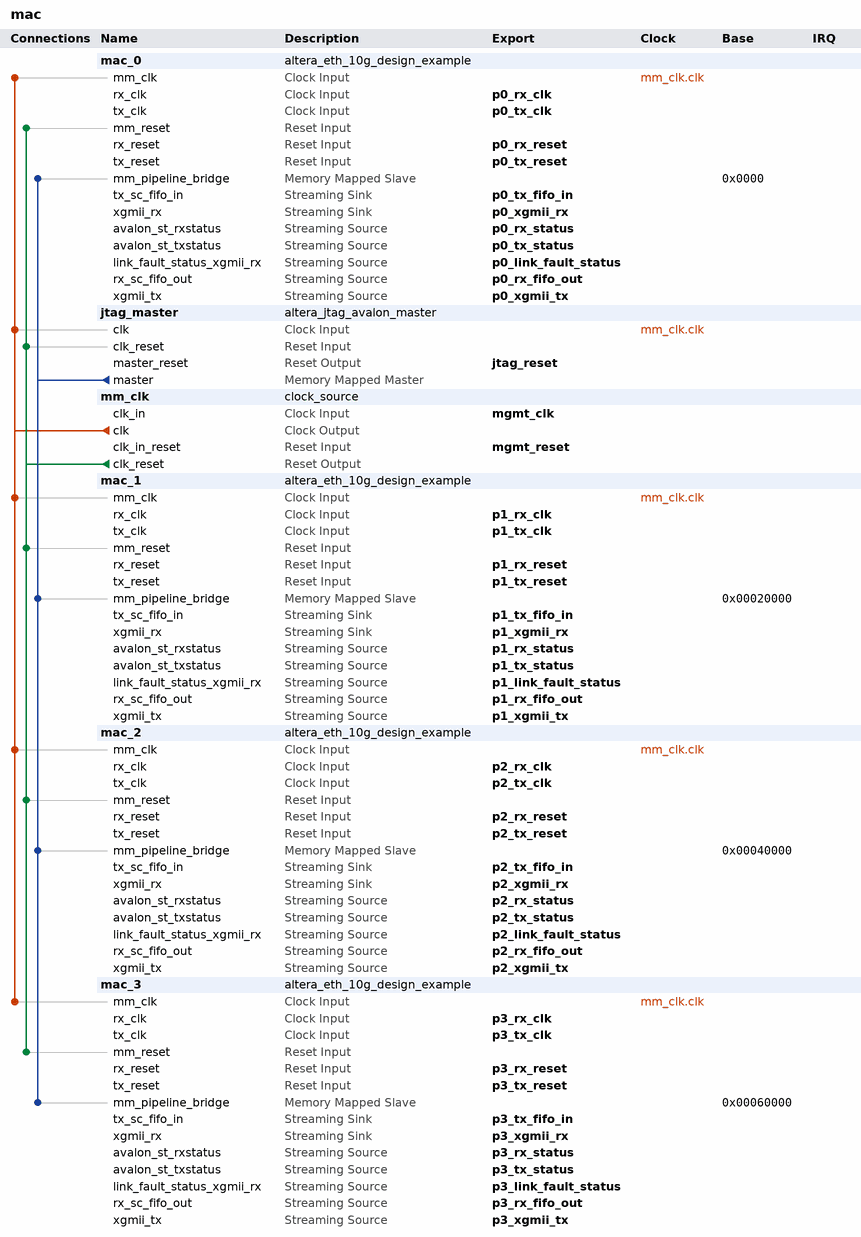
[diagram p0: system contents]
# Platform Designer (Qsys) system mac, Stratix V 5SGXEA7N2F45C2
# Parameters at their usual value, and those the tool derives, are not listed.
package require -exact qsys 14.0
create_system mac
set_project_property DEVICE_FAMILY {Stratix V}
set_project_property DEVICE 5SGXEA7N2F45C2

add_instance mac_0 altera_eth_10g_design_example 14.0
set_instance_parameter_value mac_0 DEVICE_FAMILY_TOP {Stratix V}
set_instance_parameter_value mac_0 ENABLE_MAC_LOOPBACK {10Gbps Ethernet MAC with LoopBack Enabled}
set_instance_parameter_value mac_0 CHOOSE_MDIO_2_WIRE_SERIAL_INT 1
set_instance_parameter_value mac_0 PHY_IP 2
set_instance_parameter_value mac_0 CHOOSE_FIFO 0
set_instance_parameter_value mac_0 ENABLE_TIMESTAMPING 0
set_instance_parameter_value mac_0 ENABLE_PTP_1STEP 0
set_instance_parameter_value mac_0 TSTAMP_FP_WIDTH 4
set_instance_parameter_value mac_0 PREAMBLE_PASSTHROUGH 1
set_instance_parameter_value mac_0 ENABLE_PFC 0
set_instance_parameter_value mac_0 PFC_PRIORITY_NUM 8
set_instance_parameter_value mac_0 DATAPATH_OPTION 3
set_instance_parameter_value mac_0 ENABLE_SUPP_ADDR 1
set_instance_parameter_value mac_0 INSTANTIATE_TX_CRC 1
set_instance_parameter_value mac_0 INSTANTIATE_STATISTICS 1
set_instance_parameter_value mac_0 REGISTER_BASED_STATISTICS 0
set_instance_parameter_value mac_0 ENABLE_1G10G_MAC 0
set_instance_parameter_value mac_0 ENABLE_UNIDIRECTIONAL 0
set_instance_parameter_value mac_0 MDIO_MDC_DIVISOR 32
set_instance_parameter_value mac_0 SYNC_TX_FIFO_SYMBOLS_PER_BEAT 8
set_instance_parameter_value mac_0 SYNC_TX_FIFO_BITS_PER_SYMBOL 8
set_instance_parameter_value mac_0 SYNC_TX_FIFO_DEPTH 512
set_instance_parameter_value mac_0 SYNC_TX_FIFO_ERROR_WIDTH 1
set_instance_parameter_value mac_0 SYNC_TX_USE_PACKETS 1
set_instance_parameter_value mac_0 SYNC_TX_USE_FILL 1
set_instance_parameter_value mac_0 SYNC_TX_USE_STORE_AND_FORWARD 1
set_instance_parameter_value mac_0 SYNC_TX_USE_ALMOST_FULL 0
set_instance_parameter_value mac_0 SYNC_TX_USE_ALMOST_EMPTY 0
set_instance_parameter_value mac_0 SYNC_RX_FIFO_SYMBOLS_PER_BEAT 8
set_instance_parameter_value mac_0 SYNC_RX_FIFO_BITS_PER_SYMBOL 8
set_instance_parameter_value mac_0 SYNC_RX_FIFO_DEPTH 512
set_instance_parameter_value mac_0 SYNC_RX_FIFO_ERROR_WIDTH 6
set_instance_parameter_value mac_0 SYNC_RX_USE_PACKETS 1
set_instance_parameter_value mac_0 SYNC_RX_USE_FILL 1
set_instance_parameter_value mac_0 SYNC_RX_USE_STORE_AND_FORWARD 1
set_instance_parameter_value mac_0 SYNC_RX_USE_ALMOST_FULL 1
set_instance_parameter_value mac_0 SYNC_RX_USE_ALMOST_EMPTY 1
set_instance_parameter_value mac_0 ASYNC_TX_FIFO_SYMBOLS_PER_BEAT 8
set_instance_parameter_value mac_0 ASYNC_TX_FIFO_BITS_PER_SYMBOL 8
set_instance_parameter_value mac_0 ASYNC_TX_FIFO_DEPTH 16
set_instance_parameter_value mac_0 ASYNC_TX_FIFO_ERROR_WIDTH 1
set_instance_parameter_value mac_0 ASYNC_TX_USE_PKT 1
set_instance_parameter_value mac_0 ASYNC_TX_USE_SINK_FILL 0
set_instance_parameter_value mac_0 ASYNC_TX_USE_SRC_FILL 0
set_instance_parameter_value mac_0 ASYNC_RX_FIFO_SYMBOLS_PER_BEAT 8
set_instance_parameter_value mac_0 ASYNC_RX_FIFO_BITS_PER_SYMBOL 8
set_instance_parameter_value mac_0 ASYNC_RX_FIFO_DEPTH 16
set_instance_parameter_value mac_0 ASYNC_RX_FIFO_ERROR_WIDTH 6
set_instance_parameter_value mac_0 ASYNC_RX_USE_PKT 1
set_instance_parameter_value mac_0 ASYNC_RX_USE_SINK_FILL 0
set_instance_parameter_value mac_0 ASYNC_RX_USE_SRC_FILL 0
set_instance_parameter_value mac_0 BASER_INTERFACE 0
set_instance_parameter_value mac_0 BASER_PLL_TYPE CMU
set_instance_parameter_value mac_0 BASER_STARTING_CHANNEL_NUMBER 0
set_instance_parameter_value mac_0 BASER_REF_CLK_FREQ {644.53125 MHz}
set_instance_parameter_value mac_0 BASER_TRANSMITTER_TERMINATION OCT_100_OHMS
set_instance_parameter_value mac_0 BASER_PRE_EMPHASIS_PRE_TAP 0
set_instance_parameter_value mac_0 BASER_PRE_EMPHASIS_PRE_TAP_POLARITY 0
set_instance_parameter_value mac_0 BASER_PRE_EMPHASIS_FIRST_POST_TAP 5
set_instance_parameter_value mac_0 BASER_PRE_EMPHASIS_SECOND_POST_TAP 0
set_instance_parameter_value mac_0 BASER_PRE_EMPHASIS_SECOND_POST_TAP_POLARITY 0
set_instance_parameter_value mac_0 BASER_TRANSMITTER_VOD 1
set_instance_parameter_value mac_0 BASER_RECEIVER_TERMINATION OCT_100_OHMS
set_instance_parameter_value mac_0 BASER_RECEIVER_DC_GAIN 0
set_instance_parameter_value mac_0 BASER_RECEIVER_STATIC_EQUALIZER 14
set_instance_parameter_value mac_0 BASER_EXT_PMA_CONTROL_CONF 0
set_instance_parameter_value mac_0 BASER_ENA_ADD_CONTROL_STAT 0
set_instance_parameter_value mac_0 BASER_RECOVERED_CLK_OUT 0
set_instance_parameter_value mac_0 XAUI_STARTING_CHANNEL_NUMBER 0
set_instance_parameter_value mac_0 starting_channel_number 0
set_instance_parameter_value mac_0 interface_type {Soft XAUI}
set_instance_parameter_value mac_0 soft_xaui_cfg {Only Soft XAUI is supported for this device.}
set_instance_parameter_value mac_0 hard_xaui_cfg {Only Hard XAUI is supported for this device.}
set_instance_parameter_value mac_0 gui_pll_type CMU
set_instance_parameter_value mac_0 en_synce_support 0
set_instance_parameter_value mac_0 use_control_and_status_ports 0
set_instance_parameter_value mac_0 external_pma_ctrl_reconf 0
set_instance_parameter_value mac_0 dyn_reconf 0
set_instance_parameter_value mac_0 recovered_clk_out 0
set_instance_parameter_value mac_0 number_of_interfaces 1
set_instance_parameter_value mac_0 use_rx_rate_match 0
set_instance_parameter_value mac_0 tx_termination OCT_100_OHMS
set_instance_parameter_value mac_0 tx_vod_selection 4
set_instance_parameter_value mac_0 tx_preemp_pretap 0
set_instance_parameter_value mac_0 tx_preemp_pretap_inv false
set_instance_parameter_value mac_0 tx_preemp_tap_1 0
set_instance_parameter_value mac_0 tx_preemp_tap_2 0
set_instance_parameter_value mac_0 tx_preemp_tap_2_inv false
set_instance_parameter_value mac_0 rx_common_mode 0.82v
set_instance_parameter_value mac_0 rx_termination OCT_100_OHMS
set_instance_parameter_value mac_0 rx_eq_dc_gain 0
set_instance_parameter_value mac_0 rx_eq_ctrl 0
set_instance_parameter_value mac_0 pll_external_enable 0

add_instance jtag_master altera_jtag_avalon_master 14.0

add_instance mm_clk clock_source 14.0
set_instance_parameter_value mm_clk clockFrequency 50000000

add_instance mac_1 altera_eth_10g_design_example 14.0
set_instance_parameter_value mac_1 DEVICE_FAMILY_TOP {Stratix V}
set_instance_parameter_value mac_1 ENABLE_MAC_LOOPBACK {10Gbps Ethernet MAC with LoopBack Enabled}
set_instance_parameter_value mac_1 CHOOSE_MDIO_2_WIRE_SERIAL_INT 1
set_instance_parameter_value mac_1 PHY_IP 2
set_instance_parameter_value mac_1 CHOOSE_FIFO 0
set_instance_parameter_value mac_1 ENABLE_TIMESTAMPING 0
set_instance_parameter_value mac_1 ENABLE_PTP_1STEP 0
set_instance_parameter_value mac_1 TSTAMP_FP_WIDTH 4
set_instance_parameter_value mac_1 PREAMBLE_PASSTHROUGH 1
set_instance_parameter_value mac_1 ENABLE_PFC 0
set_instance_parameter_value mac_1 PFC_PRIORITY_NUM 8
set_instance_parameter_value mac_1 DATAPATH_OPTION 3
set_instance_parameter_value mac_1 ENABLE_SUPP_ADDR 1
set_instance_parameter_value mac_1 INSTANTIATE_TX_CRC 1
set_instance_parameter_value mac_1 INSTANTIATE_STATISTICS 1
set_instance_parameter_value mac_1 REGISTER_BASED_STATISTICS 0
set_instance_parameter_value mac_1 ENABLE_1G10G_MAC 0
set_instance_parameter_value mac_1 ENABLE_UNIDIRECTIONAL 0
set_instance_parameter_value mac_1 MDIO_MDC_DIVISOR 32
set_instance_parameter_value mac_1 SYNC_TX_FIFO_SYMBOLS_PER_BEAT 8
set_instance_parameter_value mac_1 SYNC_TX_FIFO_BITS_PER_SYMBOL 8
set_instance_parameter_value mac_1 SYNC_TX_FIFO_DEPTH 512
set_instance_parameter_value mac_1 SYNC_TX_FIFO_ERROR_WIDTH 1
set_instance_parameter_value mac_1 SYNC_TX_USE_PACKETS 1
set_instance_parameter_value mac_1 SYNC_TX_USE_FILL 1
set_instance_parameter_value mac_1 SYNC_TX_USE_STORE_AND_FORWARD 1
set_instance_parameter_value mac_1 SYNC_TX_USE_ALMOST_FULL 0
set_instance_parameter_value mac_1 SYNC_TX_USE_ALMOST_EMPTY 0
set_instance_parameter_value mac_1 SYNC_RX_FIFO_SYMBOLS_PER_BEAT 8
set_instance_parameter_value mac_1 SYNC_RX_FIFO_BITS_PER_SYMBOL 8
set_instance_parameter_value mac_1 SYNC_RX_FIFO_DEPTH 512
set_instance_parameter_value mac_1 SYNC_RX_FIFO_ERROR_WIDTH 6
set_instance_parameter_value mac_1 SYNC_RX_USE_PACKETS 1
set_instance_parameter_value mac_1 SYNC_RX_USE_FILL 1
set_instance_parameter_value mac_1 SYNC_RX_USE_STORE_AND_FORWARD 1
set_instance_parameter_value mac_1 SYNC_RX_USE_ALMOST_FULL 1
set_instance_parameter_value mac_1 SYNC_RX_USE_ALMOST_EMPTY 1
set_instance_parameter_value mac_1 ASYNC_TX_FIFO_SYMBOLS_PER_BEAT 8
set_instance_parameter_value mac_1 ASYNC_TX_FIFO_BITS_PER_SYMBOL 8
set_instance_parameter_value mac_1 ASYNC_TX_FIFO_DEPTH 16
set_instance_parameter_value mac_1 ASYNC_TX_FIFO_ERROR_WIDTH 1
set_instance_parameter_value mac_1 ASYNC_TX_USE_PKT 1
set_instance_parameter_value mac_1 ASYNC_TX_USE_SINK_FILL 0
set_instance_parameter_value mac_1 ASYNC_TX_USE_SRC_FILL 0
set_instance_parameter_value mac_1 ASYNC_RX_FIFO_SYMBOLS_PER_BEAT 8
set_instance_parameter_value mac_1 ASYNC_RX_FIFO_BITS_PER_SYMBOL 8
set_instance_parameter_value mac_1 ASYNC_RX_FIFO_DEPTH 16
set_instance_parameter_value mac_1 ASYNC_RX_FIFO_ERROR_WIDTH 6
set_instance_parameter_value mac_1 ASYNC_RX_USE_PKT 1
set_instance_parameter_value mac_1 ASYNC_RX_USE_SINK_FILL 0
set_instance_parameter_value mac_1 ASYNC_RX_USE_SRC_FILL 0
set_instance_parameter_value mac_1 BASER_INTERFACE 0
set_instance_parameter_value mac_1 BASER_PLL_TYPE CMU
set_instance_parameter_value mac_1 BASER_STARTING_CHANNEL_NUMBER 0
set_instance_parameter_value mac_1 BASER_REF_CLK_FREQ {644.53125 MHz}
set_instance_parameter_value mac_1 BASER_TRANSMITTER_TERMINATION OCT_100_OHMS
set_instance_parameter_value mac_1 BASER_PRE_EMPHASIS_PRE_TAP 0
set_instance_parameter_value mac_1 BASER_PRE_EMPHASIS_PRE_TAP_POLARITY 0
set_instance_parameter_value mac_1 BASER_PRE_EMPHASIS_FIRST_POST_TAP 5
set_instance_parameter_value mac_1 BASER_PRE_EMPHASIS_SECOND_POST_TAP 0
set_instance_parameter_value mac_1 BASER_PRE_EMPHASIS_SECOND_POST_TAP_POLARITY 0
set_instance_parameter_value mac_1 BASER_TRANSMITTER_VOD 1
set_instance_parameter_value mac_1 BASER_RECEIVER_TERMINATION OCT_100_OHMS
set_instance_parameter_value mac_1 BASER_RECEIVER_DC_GAIN 0
set_instance_parameter_value mac_1 BASER_RECEIVER_STATIC_EQUALIZER 14
set_instance_parameter_value mac_1 BASER_EXT_PMA_CONTROL_CONF 0
set_instance_parameter_value mac_1 BASER_ENA_ADD_CONTROL_STAT 0
set_instance_parameter_value mac_1 BASER_RECOVERED_CLK_OUT 0
set_instance_parameter_value mac_1 XAUI_STARTING_CHANNEL_NUMBER 0
set_instance_parameter_value mac_1 starting_channel_number 0
set_instance_parameter_value mac_1 interface_type {Soft XAUI}
set_instance_parameter_value mac_1 soft_xaui_cfg {Only Soft XAUI is supported for this device.}
set_instance_parameter_value mac_1 hard_xaui_cfg {Only Hard XAUI is supported for this device.}
set_instance_parameter_value mac_1 gui_pll_type CMU
set_instance_parameter_value mac_1 en_synce_support 0
set_instance_parameter_value mac_1 use_control_and_status_ports 0
set_instance_parameter_value mac_1 external_pma_ctrl_reconf 0
set_instance_parameter_value mac_1 dyn_reconf 0
set_instance_parameter_value mac_1 recovered_clk_out 0
set_instance_parameter_value mac_1 number_of_interfaces 1
set_instance_parameter_value mac_1 use_rx_rate_match 0
set_instance_parameter_value mac_1 tx_termination OCT_100_OHMS
set_instance_parameter_value mac_1 tx_vod_selection 4
set_instance_parameter_value mac_1 tx_preemp_pretap 0
set_instance_parameter_value mac_1 tx_preemp_pretap_inv false
set_instance_parameter_value mac_1 tx_preemp_tap_1 0
set_instance_parameter_value mac_1 tx_preemp_tap_2 0
set_instance_parameter_value mac_1 tx_preemp_tap_2_inv false
set_instance_parameter_value mac_1 rx_common_mode 0.82v
set_instance_parameter_value mac_1 rx_termination OCT_100_OHMS
set_instance_parameter_value mac_1 rx_eq_dc_gain 0
set_instance_parameter_value mac_1 rx_eq_ctrl 0
set_instance_parameter_value mac_1 pll_external_enable 0

add_instance mac_2 altera_eth_10g_design_example 14.0
set_instance_parameter_value mac_2 DEVICE_FAMILY_TOP {Stratix V}
set_instance_parameter_value mac_2 ENABLE_MAC_LOOPBACK {10Gbps Ethernet MAC with LoopBack Enabled}
set_instance_parameter_value mac_2 CHOOSE_MDIO_2_WIRE_SERIAL_INT 1
set_instance_parameter_value mac_2 PHY_IP 2
set_instance_parameter_value mac_2 CHOOSE_FIFO 0
set_instance_parameter_value mac_2 ENABLE_TIMESTAMPING 0
set_instance_parameter_value mac_2 ENABLE_PTP_1STEP 0
set_instance_parameter_value mac_2 TSTAMP_FP_WIDTH 4
set_instance_parameter_value mac_2 PREAMBLE_PASSTHROUGH 1
set_instance_parameter_value mac_2 ENABLE_PFC 0
set_instance_parameter_value mac_2 PFC_PRIORITY_NUM 8
set_instance_parameter_value mac_2 DATAPATH_OPTION 3
set_instance_parameter_value mac_2 ENABLE_SUPP_ADDR 1
set_instance_parameter_value mac_2 INSTANTIATE_TX_CRC 1
set_instance_parameter_value mac_2 INSTANTIATE_STATISTICS 1
set_instance_parameter_value mac_2 REGISTER_BASED_STATISTICS 0
set_instance_parameter_value mac_2 ENABLE_1G10G_MAC 0
set_instance_parameter_value mac_2 ENABLE_UNIDIRECTIONAL 0
set_instance_parameter_value mac_2 MDIO_MDC_DIVISOR 32
set_instance_parameter_value mac_2 SYNC_TX_FIFO_SYMBOLS_PER_BEAT 8
set_instance_parameter_value mac_2 SYNC_TX_FIFO_BITS_PER_SYMBOL 8
set_instance_parameter_value mac_2 SYNC_TX_FIFO_DEPTH 512
set_instance_parameter_value mac_2 SYNC_TX_FIFO_ERROR_WIDTH 1
set_instance_parameter_value mac_2 SYNC_TX_USE_PACKETS 1
set_instance_parameter_value mac_2 SYNC_TX_USE_FILL 1
set_instance_parameter_value mac_2 SYNC_TX_USE_STORE_AND_FORWARD 1
set_instance_parameter_value mac_2 SYNC_TX_USE_ALMOST_FULL 0
set_instance_parameter_value mac_2 SYNC_TX_USE_ALMOST_EMPTY 0
set_instance_parameter_value mac_2 SYNC_RX_FIFO_SYMBOLS_PER_BEAT 8
set_instance_parameter_value mac_2 SYNC_RX_FIFO_BITS_PER_SYMBOL 8
set_instance_parameter_value mac_2 SYNC_RX_FIFO_DEPTH 512
set_instance_parameter_value mac_2 SYNC_RX_FIFO_ERROR_WIDTH 6
set_instance_parameter_value mac_2 SYNC_RX_USE_PACKETS 1
set_instance_parameter_value mac_2 SYNC_RX_USE_FILL 1
set_instance_parameter_value mac_2 SYNC_RX_USE_STORE_AND_FORWARD 1
set_instance_parameter_value mac_2 SYNC_RX_USE_ALMOST_FULL 1
set_instance_parameter_value mac_2 SYNC_RX_USE_ALMOST_EMPTY 1
set_instance_parameter_value mac_2 ASYNC_TX_FIFO_SYMBOLS_PER_BEAT 8
set_instance_parameter_value mac_2 ASYNC_TX_FIFO_BITS_PER_SYMBOL 8
set_instance_parameter_value mac_2 ASYNC_TX_FIFO_DEPTH 16
set_instance_parameter_value mac_2 ASYNC_TX_FIFO_ERROR_WIDTH 1
set_instance_parameter_value mac_2 ASYNC_TX_USE_PKT 1
set_instance_parameter_value mac_2 ASYNC_TX_USE_SINK_FILL 0
set_instance_parameter_value mac_2 ASYNC_TX_USE_SRC_FILL 0
set_instance_parameter_value mac_2 ASYNC_RX_FIFO_SYMBOLS_PER_BEAT 8
set_instance_parameter_value mac_2 ASYNC_RX_FIFO_BITS_PER_SYMBOL 8
set_instance_parameter_value mac_2 ASYNC_RX_FIFO_DEPTH 16
set_instance_parameter_value mac_2 ASYNC_RX_FIFO_ERROR_WIDTH 6
set_instance_parameter_value mac_2 ASYNC_RX_USE_PKT 1
set_instance_parameter_value mac_2 ASYNC_RX_USE_SINK_FILL 0
set_instance_parameter_value mac_2 ASYNC_RX_USE_SRC_FILL 0
set_instance_parameter_value mac_2 BASER_INTERFACE 0
set_instance_parameter_value mac_2 BASER_PLL_TYPE CMU
set_instance_parameter_value mac_2 BASER_STARTING_CHANNEL_NUMBER 0
set_instance_parameter_value mac_2 BASER_REF_CLK_FREQ {644.53125 MHz}
set_instance_parameter_value mac_2 BASER_TRANSMITTER_TERMINATION OCT_100_OHMS
set_instance_parameter_value mac_2 BASER_PRE_EMPHASIS_PRE_TAP 0
set_instance_parameter_value mac_2 BASER_PRE_EMPHASIS_PRE_TAP_POLARITY 0
set_instance_parameter_value mac_2 BASER_PRE_EMPHASIS_FIRST_POST_TAP 5
set_instance_parameter_value mac_2 BASER_PRE_EMPHASIS_SECOND_POST_TAP 0
set_instance_parameter_value mac_2 BASER_PRE_EMPHASIS_SECOND_POST_TAP_POLARITY 0
set_instance_parameter_value mac_2 BASER_TRANSMITTER_VOD 1
set_instance_parameter_value mac_2 BASER_RECEIVER_TERMINATION OCT_100_OHMS
set_instance_parameter_value mac_2 BASER_RECEIVER_DC_GAIN 0
set_instance_parameter_value mac_2 BASER_RECEIVER_STATIC_EQUALIZER 14
set_instance_parameter_value mac_2 BASER_EXT_PMA_CONTROL_CONF 0
set_instance_parameter_value mac_2 BASER_ENA_ADD_CONTROL_STAT 0
set_instance_parameter_value mac_2 BASER_RECOVERED_CLK_OUT 0
set_instance_parameter_value mac_2 XAUI_STARTING_CHANNEL_NUMBER 0
set_instance_parameter_value mac_2 starting_channel_number 0
set_instance_parameter_value mac_2 interface_type {Soft XAUI}
set_instance_parameter_value mac_2 soft_xaui_cfg {Only Soft XAUI is supported for this device.}
set_instance_parameter_value mac_2 hard_xaui_cfg {Only Hard XAUI is supported for this device.}
set_instance_parameter_value mac_2 gui_pll_type CMU
set_instance_parameter_value mac_2 en_synce_support 0
set_instance_parameter_value mac_2 use_control_and_status_ports 0
set_instance_parameter_value mac_2 external_pma_ctrl_reconf 0
set_instance_parameter_value mac_2 dyn_reconf 0
set_instance_parameter_value mac_2 recovered_clk_out 0
set_instance_parameter_value mac_2 number_of_interfaces 1
set_instance_parameter_value mac_2 use_rx_rate_match 0
set_instance_parameter_value mac_2 tx_termination OCT_100_OHMS
set_instance_parameter_value mac_2 tx_vod_selection 4
set_instance_parameter_value mac_2 tx_preemp_pretap 0
set_instance_parameter_value mac_2 tx_preemp_pretap_inv false
set_instance_parameter_value mac_2 tx_preemp_tap_1 0
set_instance_parameter_value mac_2 tx_preemp_tap_2 0
set_instance_parameter_value mac_2 tx_preemp_tap_2_inv false
set_instance_parameter_value mac_2 rx_common_mode 0.82v
set_instance_parameter_value mac_2 rx_termination OCT_100_OHMS
set_instance_parameter_value mac_2 rx_eq_dc_gain 0
set_instance_parameter_value mac_2 rx_eq_ctrl 0
set_instance_parameter_value mac_2 pll_external_enable 0

add_instance mac_3 altera_eth_10g_design_example 14.0
set_instance_parameter_value mac_3 DEVICE_FAMILY_TOP {Stratix V}
set_instance_parameter_value mac_3 ENABLE_MAC_LOOPBACK {10Gbps Ethernet MAC with LoopBack Enabled}
set_instance_parameter_value mac_3 CHOOSE_MDIO_2_WIRE_SERIAL_INT 1
set_instance_parameter_value mac_3 PHY_IP 2
set_instance_parameter_value mac_3 CHOOSE_FIFO 0
set_instance_parameter_value mac_3 ENABLE_TIMESTAMPING 0
set_instance_parameter_value mac_3 ENABLE_PTP_1STEP 0
set_instance_parameter_value mac_3 TSTAMP_FP_WIDTH 4
set_instance_parameter_value mac_3 PREAMBLE_PASSTHROUGH 1
set_instance_parameter_value mac_3 ENABLE_PFC 0
set_instance_parameter_value mac_3 PFC_PRIORITY_NUM 8
set_instance_parameter_value mac_3 DATAPATH_OPTION 3
set_instance_parameter_value mac_3 ENABLE_SUPP_ADDR 1
set_instance_parameter_value mac_3 INSTANTIATE_TX_CRC 1
set_instance_parameter_value mac_3 INSTANTIATE_STATISTICS 1
set_instance_parameter_value mac_3 REGISTER_BASED_STATISTICS 0
set_instance_parameter_value mac_3 ENABLE_1G10G_MAC 0
set_instance_parameter_value mac_3 ENABLE_UNIDIRECTIONAL 0
set_instance_parameter_value mac_3 MDIO_MDC_DIVISOR 32
set_instance_parameter_value mac_3 SYNC_TX_FIFO_SYMBOLS_PER_BEAT 8
set_instance_parameter_value mac_3 SYNC_TX_FIFO_BITS_PER_SYMBOL 8
set_instance_parameter_value mac_3 SYNC_TX_FIFO_DEPTH 512
set_instance_parameter_value mac_3 SYNC_TX_FIFO_ERROR_WIDTH 1
set_instance_parameter_value mac_3 SYNC_TX_USE_PACKETS 1
set_instance_parameter_value mac_3 SYNC_TX_USE_FILL 1
set_instance_parameter_value mac_3 SYNC_TX_USE_STORE_AND_FORWARD 1
set_instance_parameter_value mac_3 SYNC_TX_USE_ALMOST_FULL 0
set_instance_parameter_value mac_3 SYNC_TX_USE_ALMOST_EMPTY 0
set_instance_parameter_value mac_3 SYNC_RX_FIFO_SYMBOLS_PER_BEAT 8
set_instance_parameter_value mac_3 SYNC_RX_FIFO_BITS_PER_SYMBOL 8
set_instance_parameter_value mac_3 SYNC_RX_FIFO_DEPTH 512
set_instance_parameter_value mac_3 SYNC_RX_FIFO_ERROR_WIDTH 6
set_instance_parameter_value mac_3 SYNC_RX_USE_PACKETS 1
set_instance_parameter_value mac_3 SYNC_RX_USE_FILL 1
set_instance_parameter_value mac_3 SYNC_RX_USE_STORE_AND_FORWARD 1
set_instance_parameter_value mac_3 SYNC_RX_USE_ALMOST_FULL 1
set_instance_parameter_value mac_3 SYNC_RX_USE_ALMOST_EMPTY 1
set_instance_parameter_value mac_3 ASYNC_TX_FIFO_SYMBOLS_PER_BEAT 8
set_instance_parameter_value mac_3 ASYNC_TX_FIFO_BITS_PER_SYMBOL 8
set_instance_parameter_value mac_3 ASYNC_TX_FIFO_DEPTH 16
set_instance_parameter_value mac_3 ASYNC_TX_FIFO_ERROR_WIDTH 1
set_instance_parameter_value mac_3 ASYNC_TX_USE_PKT 1
set_instance_parameter_value mac_3 ASYNC_TX_USE_SINK_FILL 0
set_instance_parameter_value mac_3 ASYNC_TX_USE_SRC_FILL 0
set_instance_parameter_value mac_3 ASYNC_RX_FIFO_SYMBOLS_PER_BEAT 8
set_instance_parameter_value mac_3 ASYNC_RX_FIFO_BITS_PER_SYMBOL 8
set_instance_parameter_value mac_3 ASYNC_RX_FIFO_DEPTH 16
set_instance_parameter_value mac_3 ASYNC_RX_FIFO_ERROR_WIDTH 6
set_instance_parameter_value mac_3 ASYNC_RX_USE_PKT 1
set_instance_parameter_value mac_3 ASYNC_RX_USE_SINK_FILL 0
set_instance_parameter_value mac_3 ASYNC_RX_USE_SRC_FILL 0
set_instance_parameter_value mac_3 BASER_INTERFACE 0
set_instance_parameter_value mac_3 BASER_PLL_TYPE CMU
set_instance_parameter_value mac_3 BASER_STARTING_CHANNEL_NUMBER 0
set_instance_parameter_value mac_3 BASER_REF_CLK_FREQ {644.53125 MHz}
set_instance_parameter_value mac_3 BASER_TRANSMITTER_TERMINATION OCT_100_OHMS
set_instance_parameter_value mac_3 BASER_PRE_EMPHASIS_PRE_TAP 0
set_instance_parameter_value mac_3 BASER_PRE_EMPHASIS_PRE_TAP_POLARITY 0
set_instance_parameter_value mac_3 BASER_PRE_EMPHASIS_FIRST_POST_TAP 5
set_instance_parameter_value mac_3 BASER_PRE_EMPHASIS_SECOND_POST_TAP 0
set_instance_parameter_value mac_3 BASER_PRE_EMPHASIS_SECOND_POST_TAP_POLARITY 0
set_instance_parameter_value mac_3 BASER_TRANSMITTER_VOD 1
set_instance_parameter_value mac_3 BASER_RECEIVER_TERMINATION OCT_100_OHMS
set_instance_parameter_value mac_3 BASER_RECEIVER_DC_GAIN 0
set_instance_parameter_value mac_3 BASER_RECEIVER_STATIC_EQUALIZER 14
set_instance_parameter_value mac_3 BASER_EXT_PMA_CONTROL_CONF 0
set_instance_parameter_value mac_3 BASER_ENA_ADD_CONTROL_STAT 0
set_instance_parameter_value mac_3 BASER_RECOVERED_CLK_OUT 0
set_instance_parameter_value mac_3 XAUI_STARTING_CHANNEL_NUMBER 0
set_instance_parameter_value mac_3 starting_channel_number 0
set_instance_parameter_value mac_3 interface_type {Soft XAUI}
set_instance_parameter_value mac_3 soft_xaui_cfg {Only Soft XAUI is supported for this device.}
set_instance_parameter_value mac_3 hard_xaui_cfg {Only Hard XAUI is supported for this device.}
set_instance_parameter_value mac_3 gui_pll_type CMU
set_instance_parameter_value mac_3 en_synce_support 0
set_instance_parameter_value mac_3 use_control_and_status_ports 0
set_instance_parameter_value mac_3 external_pma_ctrl_reconf 0
set_instance_parameter_value mac_3 dyn_reconf 0
set_instance_parameter_value mac_3 recovered_clk_out 0
set_instance_parameter_value mac_3 number_of_interfaces 1
set_instance_parameter_value mac_3 use_rx_rate_match 0
set_instance_parameter_value mac_3 tx_termination OCT_100_OHMS
set_instance_parameter_value mac_3 tx_vod_selection 4
set_instance_parameter_value mac_3 tx_preemp_pretap 0
set_instance_parameter_value mac_3 tx_preemp_pretap_inv false
set_instance_parameter_value mac_3 tx_preemp_tap_1 0
set_instance_parameter_value mac_3 tx_preemp_tap_2 0
set_instance_parameter_value mac_3 tx_preemp_tap_2_inv false
set_instance_parameter_value mac_3 rx_common_mode 0.82v
set_instance_parameter_value mac_3 rx_termination OCT_100_OHMS
set_instance_parameter_value mac_3 rx_eq_dc_gain 0
set_instance_parameter_value mac_3 rx_eq_ctrl 0
set_instance_parameter_value mac_3 pll_external_enable 0

# connections
add_connection mm_clk.clk jtag_master.clk clock
add_connection mm_clk.clk mac_0.mm_clk clock
add_connection mm_clk.clk mac_1.mm_clk clock
add_connection mm_clk.clk mac_2.mm_clk clock
add_connection mm_clk.clk mac_3.mm_clk clock
add_connection mm_clk.clk_reset jtag_master.clk_reset reset
add_connection mm_clk.clk_reset mac_0.mm_reset reset
add_connection mm_clk.clk_reset mac_1.mm_reset reset
add_connection mm_clk.clk_reset mac_2.mm_reset reset
add_connection mm_clk.clk_reset mac_3.mm_reset reset
add_connection jtag_master.master mac_0.mm_pipeline_bridge avalon
set_connection_parameter_value jtag_master.master/mac_0.mm_pipeline_bridge baseAddress 0x0000
add_connection jtag_master.master mac_1.mm_pipeline_bridge avalon
set_connection_parameter_value jtag_master.master/mac_1.mm_pipeline_bridge baseAddress 0x00020000
add_connection jtag_master.master mac_2.mm_pipeline_bridge avalon
set_connection_parameter_value jtag_master.master/mac_2.mm_pipeline_bridge baseAddress 0x00040000
add_connection jtag_master.master mac_3.mm_pipeline_bridge avalon
set_connection_parameter_value jtag_master.master/mac_3.mm_pipeline_bridge baseAddress 0x00060000

# exported interfaces
add_interface p0_tx_clk clock sink
set_interface_property p0_tx_clk EXPORT_OF mac_0.tx_clk
add_interface p0_tx_reset reset sink
set_interface_property p0_tx_reset EXPORT_OF mac_0.tx_reset
add_interface p0_rx_status avalon_streaming source
set_interface_property p0_rx_status EXPORT_OF mac_0.avalon_st_rxstatus
add_interface p0_link_fault_status avalon_streaming source
set_interface_property p0_link_fault_status EXPORT_OF mac_0.link_fault_status_xgmii_rx
add_interface p0_tx_fifo_in avalon_streaming sink
set_interface_property p0_tx_fifo_in EXPORT_OF mac_0.tx_sc_fifo_in
add_interface p0_rx_fifo_out avalon_streaming source
set_interface_property p0_rx_fifo_out EXPORT_OF mac_0.rx_sc_fifo_out
add_interface mgmt_clk clock sink
set_interface_property mgmt_clk EXPORT_OF mm_clk.clk_in
add_interface mgmt_reset reset sink
set_interface_property mgmt_reset EXPORT_OF mm_clk.clk_in_reset
add_interface p0_tx_status avalon_streaming source
set_interface_property p0_tx_status EXPORT_OF mac_0.avalon_st_txstatus
add_interface jtag_reset reset source
set_interface_property jtag_reset EXPORT_OF jtag_master.master_reset
add_interface p0_xgmii_rx avalon_streaming sink
set_interface_property p0_xgmii_rx EXPORT_OF mac_0.xgmii_rx
add_interface p0_xgmii_tx avalon_streaming source
set_interface_property p0_xgmii_tx EXPORT_OF mac_0.xgmii_tx
add_interface p0_rx_clk clock sink
set_interface_property p0_rx_clk EXPORT_OF mac_0.rx_clk
add_interface p0_rx_reset reset sink
set_interface_property p0_rx_reset EXPORT_OF mac_0.rx_reset
add_interface p1_tx_clk clock sink
set_interface_property p1_tx_clk EXPORT_OF mac_1.tx_clk
add_interface p1_tx_reset reset sink
set_interface_property p1_tx_reset EXPORT_OF mac_1.tx_reset
add_interface p1_rx_clk clock sink
set_interface_property p1_rx_clk EXPORT_OF mac_1.rx_clk
add_interface p1_rx_reset reset sink
set_interface_property p1_rx_reset EXPORT_OF mac_1.rx_reset
add_interface p2_tx_clk clock sink
set_interface_property p2_tx_clk EXPORT_OF mac_2.tx_clk
add_interface p2_tx_reset reset sink
set_interface_property p2_tx_reset EXPORT_OF mac_2.tx_reset
add_interface p2_rx_clk clock sink
set_interface_property p2_rx_clk EXPORT_OF mac_2.rx_clk
add_interface p2_rx_reset reset sink
set_interface_property p2_rx_reset EXPORT_OF mac_2.rx_reset
add_interface p3_tx_clk clock sink
set_interface_property p3_tx_clk EXPORT_OF mac_3.tx_clk
add_interface p3_tx_reset reset sink
set_interface_property p3_tx_reset EXPORT_OF mac_3.tx_reset
add_interface p3_rx_clk clock sink
set_interface_property p3_rx_clk EXPORT_OF mac_3.rx_clk
add_interface p3_rx_reset reset sink
set_interface_property p3_rx_reset EXPORT_OF mac_3.rx_reset
add_interface p1_rx_status avalon_streaming source
set_interface_property p1_rx_status EXPORT_OF mac_1.avalon_st_rxstatus
add_interface p1_link_fault_status avalon_streaming source
set_interface_property p1_link_fault_status EXPORT_OF mac_1.link_fault_status_xgmii_rx
add_interface p1_tx_fifo_in avalon_streaming sink
set_interface_property p1_tx_fifo_in EXPORT_OF mac_1.tx_sc_fifo_in
add_interface p1_rx_fifo_out avalon_streaming source
set_interface_property p1_rx_fifo_out EXPORT_OF mac_1.rx_sc_fifo_out
add_interface p1_xgmii_rx avalon_streaming sink
set_interface_property p1_xgmii_rx EXPORT_OF mac_1.xgmii_rx
add_interface p1_xgmii_tx avalon_streaming source
set_interface_property p1_xgmii_tx EXPORT_OF mac_1.xgmii_tx
add_interface p1_tx_status avalon_streaming source
set_interface_property p1_tx_status EXPORT_OF mac_1.avalon_st_txstatus
add_interface p2_rx_status avalon_streaming source
set_interface_property p2_rx_status EXPORT_OF mac_2.avalon_st_rxstatus
add_interface p2_link_fault_status avalon_streaming source
set_interface_property p2_link_fault_status EXPORT_OF mac_2.link_fault_status_xgmii_rx
add_interface p2_tx_fifo_in avalon_streaming sink
set_interface_property p2_tx_fifo_in EXPORT_OF mac_2.tx_sc_fifo_in
add_interface p2_rx_fifo_out avalon_streaming source
set_interface_property p2_rx_fifo_out EXPORT_OF mac_2.rx_sc_fifo_out
add_interface p2_xgmii_rx avalon_streaming sink
set_interface_property p2_xgmii_rx EXPORT_OF mac_2.xgmii_rx
add_interface p2_xgmii_tx avalon_streaming source
set_interface_property p2_xgmii_tx EXPORT_OF mac_2.xgmii_tx
add_interface p2_tx_status avalon_streaming source
set_interface_property p2_tx_status EXPORT_OF mac_2.avalon_st_txstatus
add_interface p3_rx_status avalon_streaming source
set_interface_property p3_rx_status EXPORT_OF mac_3.avalon_st_rxstatus
add_interface p3_link_fault_status avalon_streaming source
set_interface_property p3_link_fault_status EXPORT_OF mac_3.link_fault_status_xgmii_rx
add_interface p3_tx_fifo_in avalon_streaming sink
set_interface_property p3_tx_fifo_in EXPORT_OF mac_3.tx_sc_fifo_in
add_interface p3_rx_fifo_out avalon_streaming source
set_interface_property p3_rx_fifo_out EXPORT_OF mac_3.rx_sc_fifo_out
add_interface p3_xgmii_rx avalon_streaming sink
set_interface_property p3_xgmii_rx EXPORT_OF mac_3.xgmii_rx
add_interface p3_xgmii_tx avalon_streaming source
set_interface_property p3_xgmii_tx EXPORT_OF mac_3.xgmii_tx
add_interface p3_tx_status avalon_streaming source
set_interface_property p3_tx_status EXPORT_OF mac_3.avalon_st_txstatus

set_interconnect_requirement {$system} qsys_mm.clockCrossingAdapter HANDSHAKE
set_interconnect_requirement {$system} qsys_mm.maxAdditionalLatency 1

save_system mac.qsys
